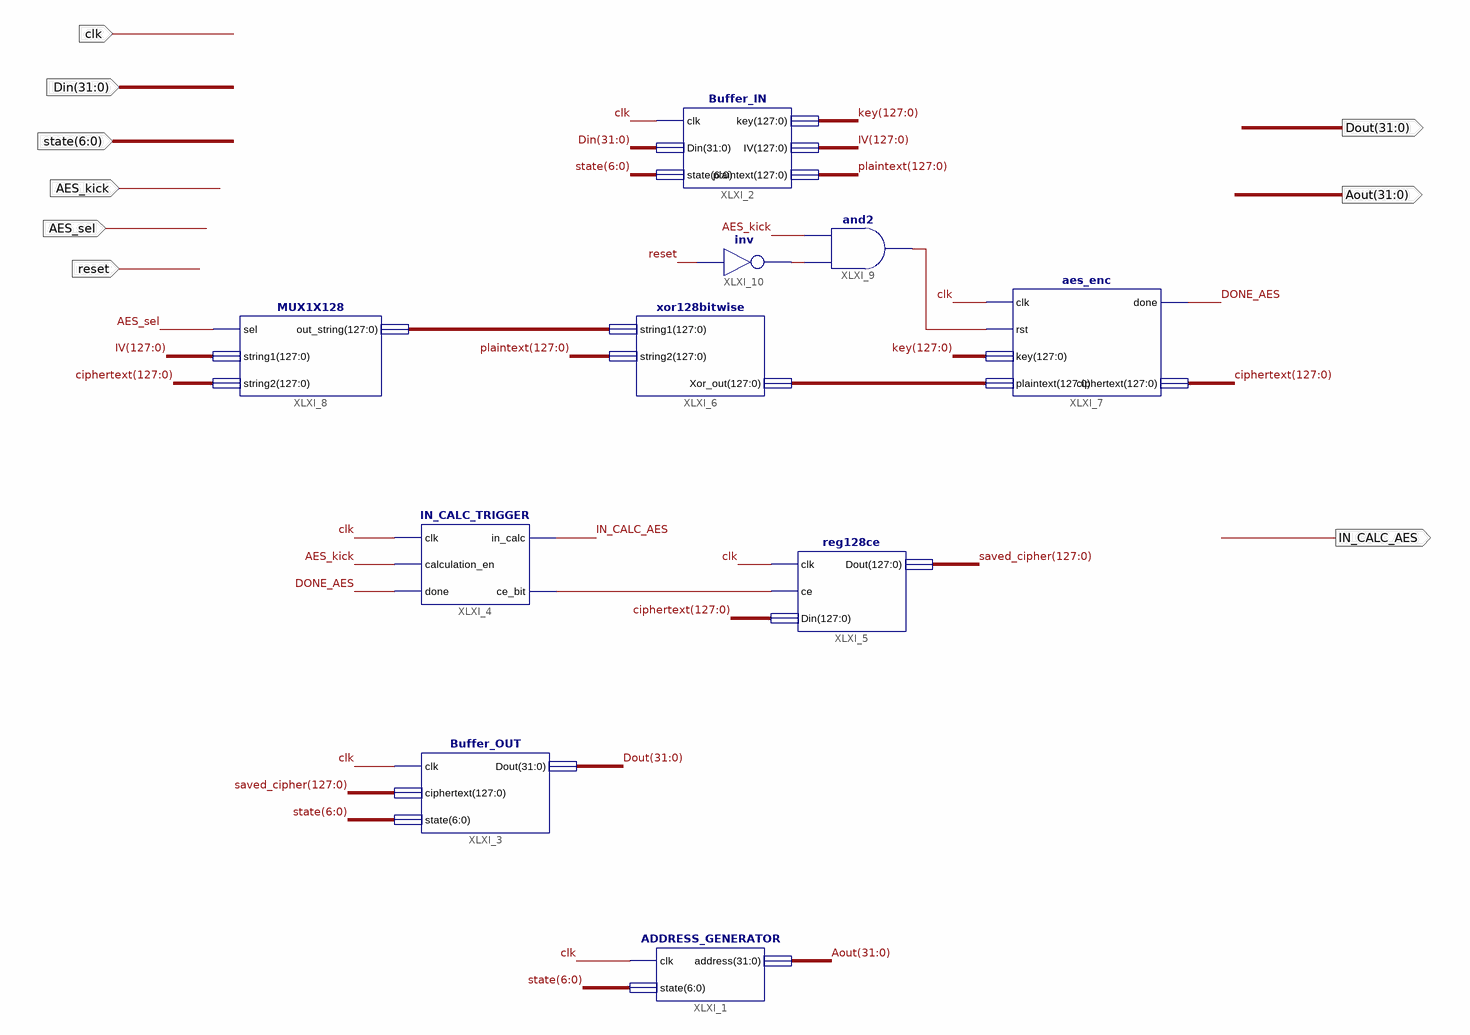
[diagram p0: schematic sheet 1]
// Xilinx ISE schematic CBC_Data_Path.sch (spartan6) as structural Verilog: 10 symbols, 9 ports
module CBC_Data_Path (
  input  clk,
  input  [31:0] Din,
  input  [6:0] state,
  input  AES_kick,
  input  AES_sel,
  input  reset,
  output IN_CALC_AES,
  output [31:0] Dout,
  output [31:0] Aout
);

  wire DONE_AES, XLXN_15, XLXN_27, XLXN_31;
  wire [127:0] ciphertext, IV, key, plaintext, saved_cipher, XLXN_20, XLXN_26;

  ADDRESS_GENERATOR XLXI_1 (.clk(clk), .state(state), .address(Aout));
  Buffer_IN XLXI_2 (.clk(clk), .Din(Din), .state(state), .key(key), .IV(IV), .plaintext(plaintext));
  Buffer_OUT XLXI_3 (.clk(clk), .ciphertext(saved_cipher), .state(state), .Dout(Dout));
  IN_CALC_TRIGGER XLXI_4 (
    .clk(clk), .calculation_en(AES_kick), .done(DONE_AES), .in_calc(IN_CALC_AES), .ce_bit(XLXN_15));
  xor128bitwise XLXI_6 (.string1(XLXN_20), .string2(plaintext), .Xor_out(XLXN_26));
  MUX1X128 XLXI_8 (.sel(AES_sel), .string1(IV), .string2(ciphertext), .out_string(XLXN_20));
  aes_enc XLXI_7 (.clk(clk), .rst(XLXN_27), .key(key), .plaintext(XLXN_26), .done(DONE_AES), .ciphertext(ciphertext));
  reg128ce XLXI_5 (.clk(clk), .ce(XLXN_15), .Din(ciphertext), .Dout(saved_cipher));
  and XLXI_9 (XLXN_27, XLXN_31, AES_kick);
  not XLXI_10 (XLXN_31, reset);
endmodule
